# Altium schematic sheet 00_PINOUT.SchDoc
size A2
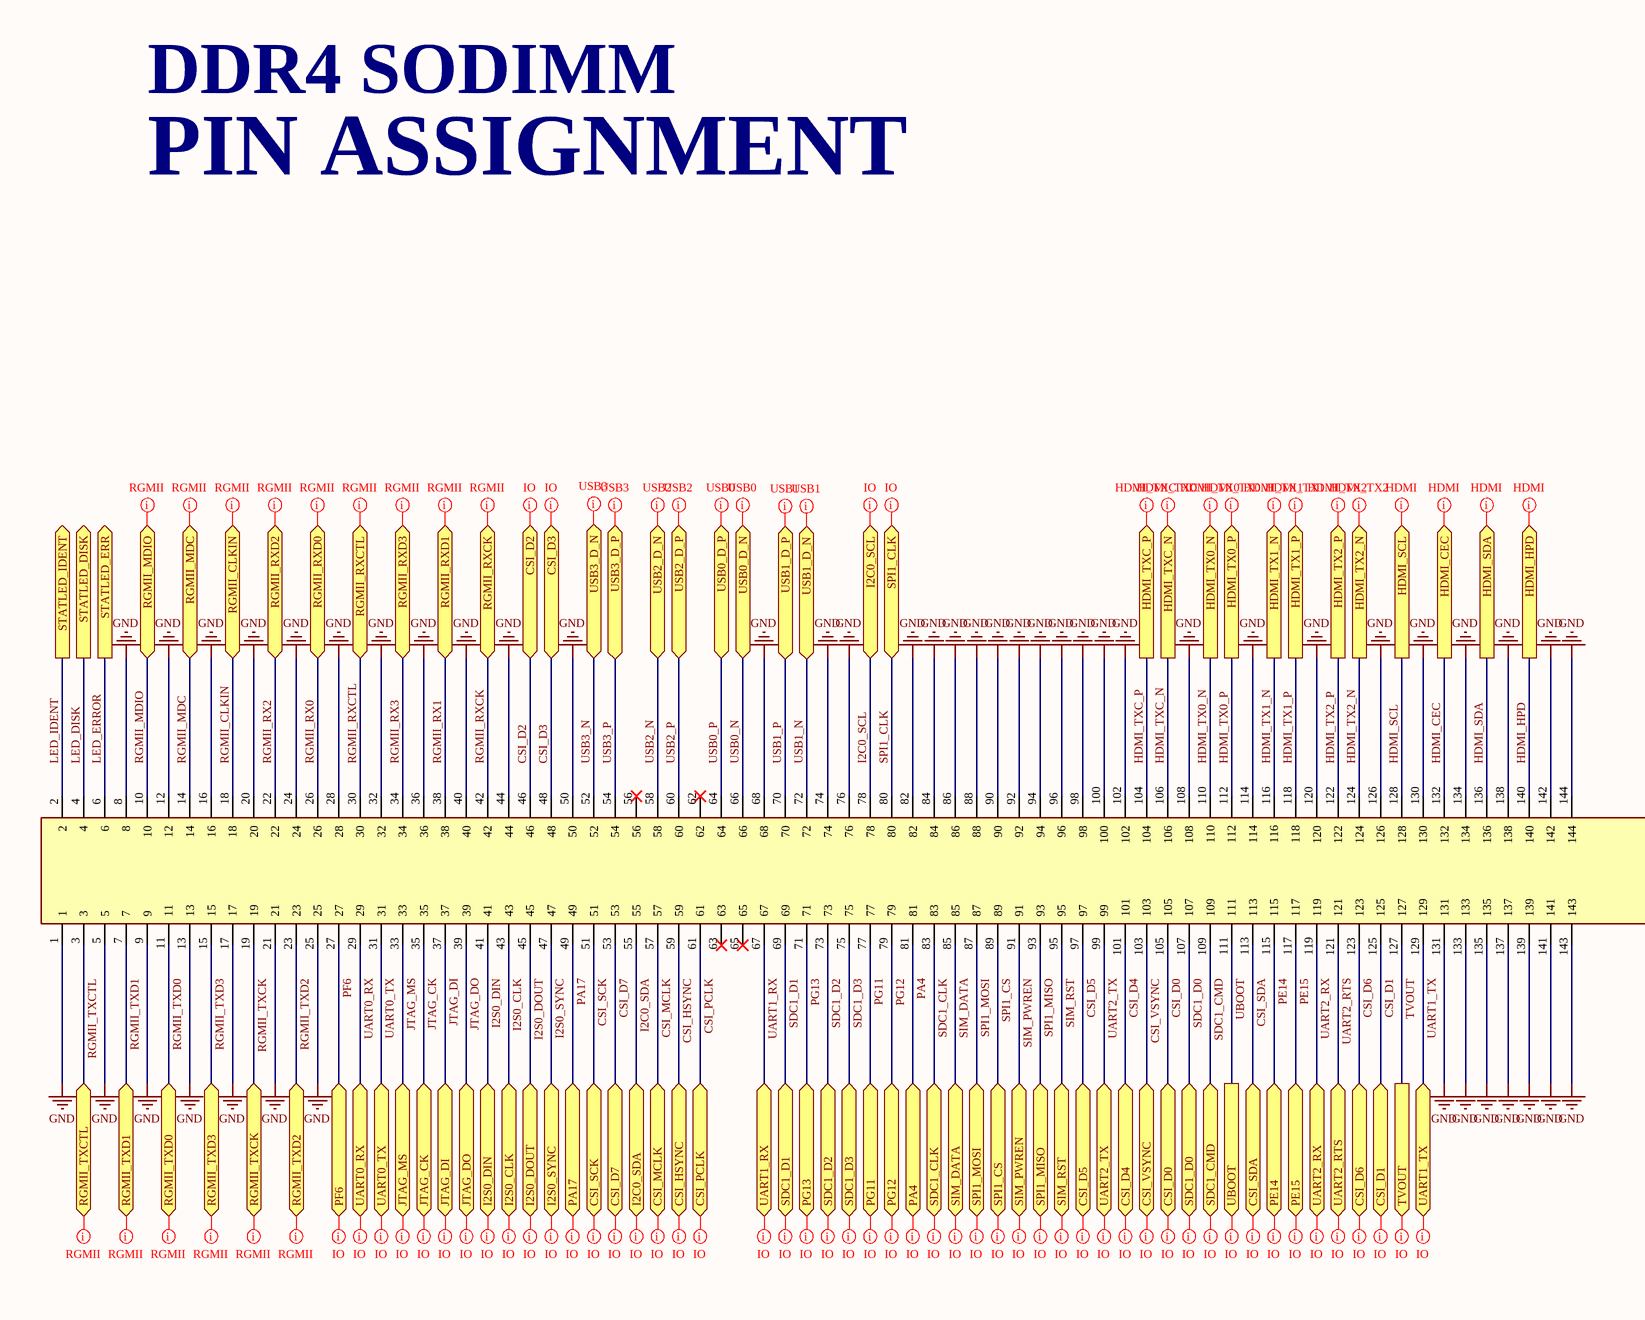
[diagram p0: 00_PINOUT.SchDoc, left]
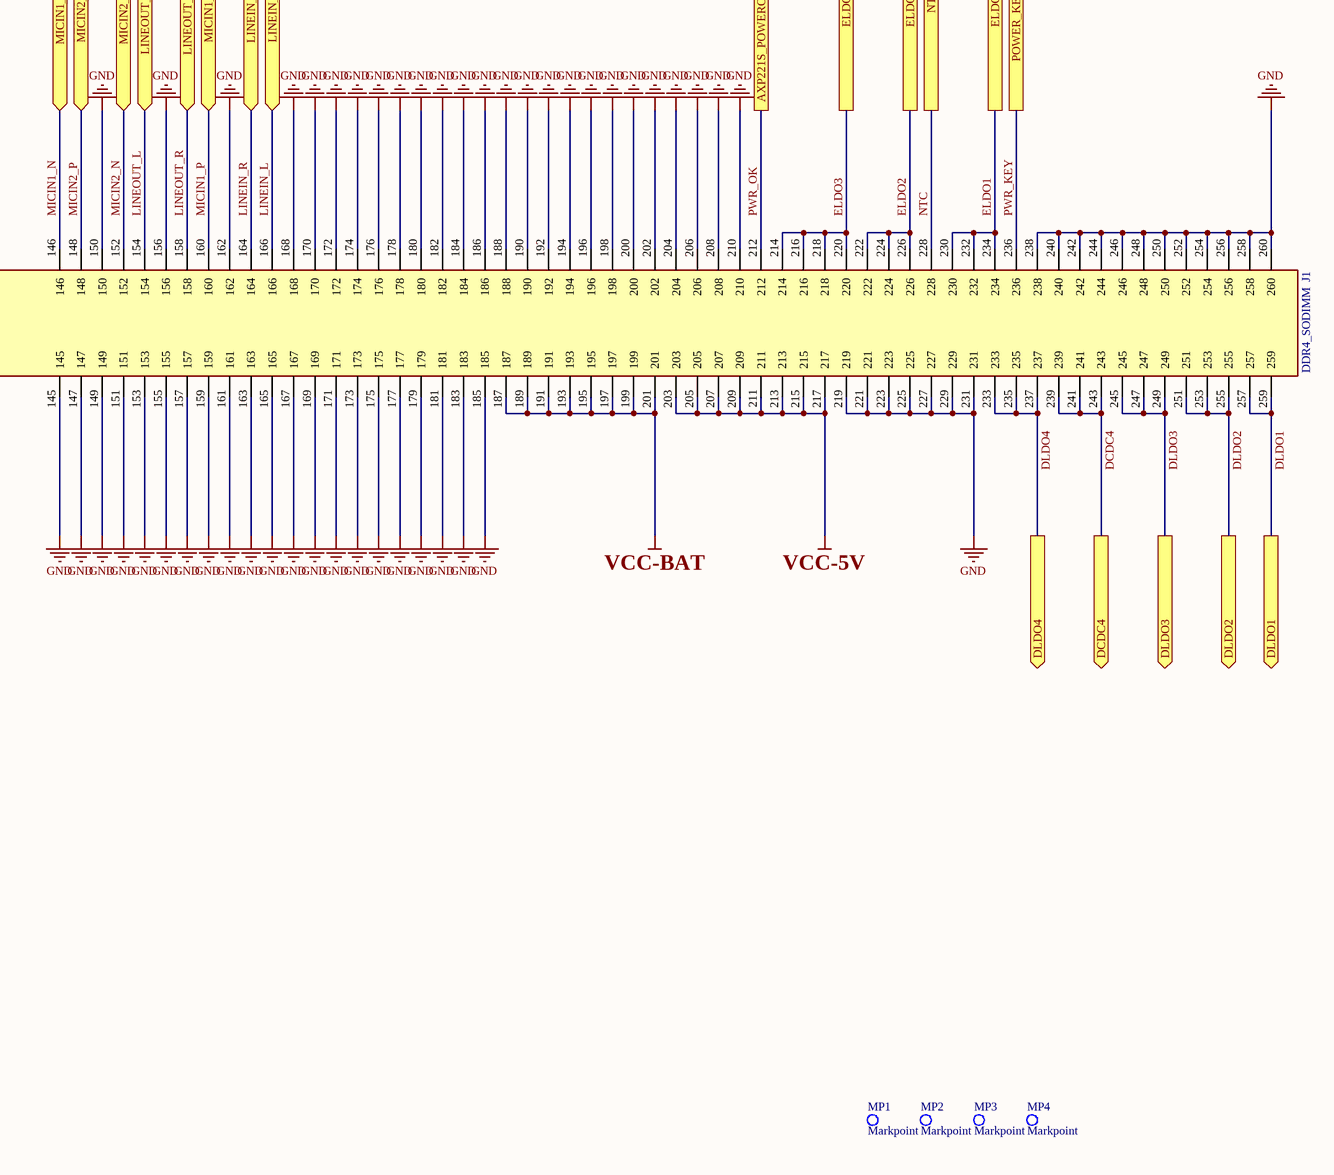
[diagram p1: 00_PINOUT.SchDoc, right]

## Parts
J1  DDR4_SODIMM  [DDR4_SODIMM]
MP1  Markpoint  [MARKPOINT]
MP2  Markpoint  [MARKPOINT]
MP3  Markpoint  [MARKPOINT]
MP4  Markpoint  [MARKPOINT]

## Ports
AXP221S_POWEROK (out), CSI_D0 (bidir), CSI_D1 (bidir), CSI_D2 (bidir), CSI_D3 (bidir), CSI_D4 (bidir), CSI_D5 (bidir), CSI_D6 (bidir), CSI_D7 (bidir), CSI_HSYNC (bidir), CSI_MCLK (bidir), CSI_PCLK (bidir), CSI_SCK (bidir), CSI_SDA (bidir), CSI_VSYNC (bidir), DCDC4 (out), DLDO1 (out), DLDO2 (out), DLDO3 (out), DLDO4 (out), ELDO1 (out), ELDO2 (out), ELDO3 (out), HDMI_CEC (out), HDMI_HPD (out), HDMI_SCL (out), HDMI_SDA (out), HDMI_TX0_N (out), HDMI_TX0_P (out), HDMI_TX1_N (out), HDMI_TX1_P (out), HDMI_TX2_N (out), HDMI_TX2_P (out), HDMI_TXC_N (out), HDMI_TXC_P (out), I2C0_SCL (bidir), I2C0_SDA (bidir), I2S0_CLK (bidir), I2S0_DIN (bidir), I2S0_DOUT (bidir), I2S0_SYNC (bidir), JTAG_CK (bidir), JTAG_DI (bidir), JTAG_DO (bidir), JTAG_MS (bidir), LINEIN_L (bidir), LINEIN_R (bidir), LINEOUT_L (bidir), LINEOUT_R (bidir), MICIN1_N (bidir), MICIN1_P (bidir), MICIN2_N (bidir), MICIN2_P (bidir), NTC (out), PA4 (bidir), PA17 (bidir), PE14 (bidir), PE15 (bidir), PF6 (bidir), PG11 (bidir), PG12 (bidir), PG13 (bidir), POWER_KEY (out), RGMII_CLKIN (bidir), RGMII_MDC (bidir), RGMII_MDIO (bidir), RGMII_RXCK (bidir), RGMII_RXCTL (bidir), RGMII_RXD0 (bidir), RGMII_RXD1 (bidir), RGMII_RXD2 (bidir), RGMII_RXD3 (bidir), RGMII_TXCK (bidir), RGMII_TXCTL (bidir), RGMII_TXD0 (bidir), RGMII_TXD1 (bidir), RGMII_TXD2 (bidir), RGMII_TXD3 (bidir), SDC1_CLK (bidir), SDC1_CMD (bidir), SDC1_D0 (bidir), SDC1_D1 (bidir), SDC1_D2 (bidir), SDC1_D3 (bidir), SIM_DATA (bidir), SIM_PWREN (bidir), SIM_RST (bidir), SPI1_CLK (bidir), SPI1_CS (bidir), SPI1_MISO (bidir), SPI1_MOSI (bidir), STATLED_DISK (out), STATLED_ERR (out), STATLED_IDENT (out), TVOUT (out), UART0_RX (bidir), UART0_TX (bidir), UART1_RX (bidir), UART1_TX (bidir), UART2_RTS (bidir), UART2_RX (bidir), UART2_TX (bidir), UBOOT (out), USB0_D_N (bidir), USB0_D_P (bidir), USB1_D_N (bidir), USB1_D_P (bidir), USB2_D_N (bidir), USB2_D_P (bidir), USB3_D_N (bidir), USB3_D_P (bidir)

## Nets
GND: J1.1 J1.5 J1.8 J1.9 J1.12 J1.13 J1.16 J1.17 J1.20 J1.21 J1.24 J1.25 J1.28 J1.32 J1.36 J1.40 J1.44 J1.50 J1.68 J1.74 J1.76 J1.82 J1.84 J1.86 J1.88 J1.90 J1.92 J1.94 J1.96 J1.98 J1.100 J1.102 J1.108 J1.114 J1.120 J1.126 J1.130 J1.131 J1.133 J1.134 J1.135 J1.137 J1.138 J1.139 J1.141 J1.142 J1.143 J1.144 J1.145 J1.147 J1.149 J1.150 J1.151 J1.153 J1.155 J1.156 J1.157 J1.159 J1.161 J1.162 J1.163 J1.165 J1.167 J1.168 J1.169 J1.170 J1.171 J1.172 J1.173 J1.174 J1.175 J1.176 J1.177 J1.178 J1.179 J1.180 J1.181 J1.182 J1.183 J1.184 J1.185 J1.186 J1.188 J1.190 J1.192 J1.194 J1.196 J1.198 J1.200 J1.202 J1.204 J1.206 J1.208 J1.210 J1.219 J1.221 J1.223 J1.225 J1.227 J1.229 J1.231 J1.238 J1.240 J1.242 J1.244 J1.246 J1.248 J1.250 J1.252 J1.254 J1.256 J1.258 J1.260
VCC-5V: J1.203 J1.205 J1.207 J1.209 J1.211 J1.213 J1.215 J1.217
VCC-BAT: J1.187 J1.189 J1.191 J1.193 J1.195 J1.197 J1.199 J1.201
CSI_D0: J1.105 ; port CSI_D0
CSI_D1: J1.125 ; port CSI_D1
CSI_D2: J1.46 ; port CSI_D2
CSI_D3: J1.48 ; port CSI_D3
CSI_D4: J1.101 ; port CSI_D4
CSI_D5: J1.97 ; port CSI_D5
CSI_D6: J1.123 ; port CSI_D6
CSI_D7: J1.53 ; port CSI_D7
CSI_HSYNC: J1.59 ; port CSI_HSYNC
CSI_MCLK: J1.57 ; port CSI_MCLK
CSI_PCLK: J1.61 ; port CSI_PCLK
CSI_SCK: J1.51 ; port CSI_SCK
CSI_SDA: J1.113 ; port CSI_SDA
CSI_VSYNC: J1.103 ; port CSI_VSYNC
DCDC4: J1.239 J1.241 J1.243 ; port DCDC4
DLDO1: J1.257 J1.259 ; port DLDO1
DLDO2: J1.251 J1.253 J1.255 ; port DLDO2
DLDO3: J1.245 J1.247 J1.249 ; port DLDO3
DLDO4: J1.233 J1.235 J1.237 ; port DLDO4
ELDO1: J1.230 J1.232 J1.234 ; port ELDO1
ELDO2: J1.222 J1.224 J1.226 ; port ELDO2
ELDO3: J1.214 J1.216 J1.218 J1.220 ; port ELDO3
HDMI_CEC: J1.132 ; port HDMI_CEC
HDMI_HPD: J1.140 ; port HDMI_HPD
HDMI_SCL: J1.128 ; port HDMI_SCL
HDMI_SDA: J1.136 ; port HDMI_SDA
HDMI_TX0_N: J1.110 ; port HDMI_TX0_N
HDMI_TX0_P: J1.112 ; port HDMI_TX0_P
HDMI_TX1_N: J1.116 ; port HDMI_TX1_N
HDMI_TX1_P: J1.118 ; port HDMI_TX1_P
HDMI_TX2_N: J1.124 ; port HDMI_TX2_N
HDMI_TX2_P: J1.122 ; port HDMI_TX2_P
HDMI_TXC_N: J1.106 ; port HDMI_TXC_N
HDMI_TXC_P: J1.104 ; port HDMI_TXC_P
I2C0_SCL: J1.78 ; port I2C0_SCL
I2C0_SDA: J1.55 ; port I2C0_SDA
I2S0_CLK: J1.43 ; port I2S0_CLK
I2S0_DIN: J1.41 ; port I2S0_DIN
I2S0_DOUT: J1.45 ; port I2S0_DOUT
I2S0_SYNC: J1.47 ; port I2S0_SYNC
JTAG_CK: J1.35 ; port JTAG_CK
JTAG_DI: J1.37 ; port JTAG_DI
JTAG_DO: J1.39 ; port JTAG_DO
JTAG_MS: J1.33 ; port JTAG_MS
LED_DISK: J1.4 ; port STATLED_DISK
LED_ERROR: J1.6 ; port STATLED_ERR
LED_IDENT: J1.2 ; port STATLED_IDENT
LINEIN_L: J1.166 ; port LINEIN_L
LINEIN_R: J1.164 ; port LINEIN_R
LINEOUT_L: J1.154 ; port LINEOUT_L
LINEOUT_R: J1.158 ; port LINEOUT_R
MICIN1_N: J1.146 ; port MICIN1_N
MICIN1_P: J1.160 ; port MICIN1_P
MICIN2_N: J1.152 ; port MICIN2_N
MICIN2_P: J1.148 ; port MICIN2_P
NTC: J1.228 ; port NTC
PA4: J1.81 ; port PA4
PA17: J1.49 ; port PA17
PE14: J1.115 ; port PE14
PE15: J1.117 ; port PE15
PF6: J1.27 ; port PF6
PG11: J1.77 ; port PG11
PG12: J1.79 ; port PG12
PG13: J1.71 ; port PG13
PWR_KEY: J1.236 ; port POWER_KEY
PWR_OK: J1.212 ; port AXP221S_POWEROK
RGMII_CLKIN: J1.18 ; port RGMII_CLKIN
RGMII_MDC: J1.14 ; port RGMII_MDC
RGMII_MDIO: J1.10 ; port RGMII_MDIO
RGMII_RX0: J1.26 ; port RGMII_RXD0
RGMII_RX1: J1.38 ; port RGMII_RXD1
RGMII_RX2: J1.22 ; port RGMII_RXD2
RGMII_RX3: J1.34 ; port RGMII_RXD3
RGMII_RXCK: J1.42 ; port RGMII_RXCK
RGMII_RXCTL: J1.30 ; port RGMII_RXCTL
RGMII_TXCK: J1.19 ; port RGMII_TXCK
RGMII_TXCTL: J1.3 ; port RGMII_TXCTL
RGMII_TXD0: J1.11 ; port RGMII_TXD0
RGMII_TXD1: J1.7 ; port RGMII_TXD1
RGMII_TXD2: J1.23 ; port RGMII_TXD2
RGMII_TXD3: J1.15 ; port RGMII_TXD3
SDC1_CLK: J1.83 ; port SDC1_CLK
SDC1_CMD: J1.109 ; port SDC1_CMD
SDC1_D0: J1.107 ; port SDC1_D0
SDC1_D1: J1.69 ; port SDC1_D1
SDC1_D2: J1.73 ; port SDC1_D2
SDC1_D3: J1.75 ; port SDC1_D3
SIM_DATA: J1.85 ; port SIM_DATA
SIM_PWREN: J1.91 ; port SIM_PWREN
SIM_RST: J1.95 ; port SIM_RST
SPI1_CLK: J1.80 ; port SPI1_CLK
SPI1_CS: J1.89 ; port SPI1_CS
SPI1_MISO: J1.93 ; port SPI1_MISO
SPI1_MOSI: J1.87 ; port SPI1_MOSI
TVOUT: J1.127 ; port TVOUT
UART0_RX: J1.29 ; port UART0_RX
UART0_TX: J1.31 ; port UART0_TX
UART1_RX: J1.67 ; port UART1_RX
UART1_TX: J1.129 ; port UART1_TX
UART2_RTS: J1.121 ; port UART2_RTS
UART2_RX: J1.119 ; port UART2_RX
UART2_TX: J1.99 ; port UART2_TX
UBOOT: J1.111 ; port UBOOT
USB0_N: J1.66 ; port USB0_D_N
USB0_P: J1.64 ; port USB0_D_P
USB1_N: J1.72 ; port USB1_D_N
USB1_P: J1.70 ; port USB1_D_P
USB2_N: J1.58 ; port USB2_D_N
USB2_P: J1.60 ; port USB2_D_P
USB3_N: J1.52 ; port USB3_D_N
USB3_P: J1.54 ; port USB3_D_P

Not connected (* = marked no-connect by the designer): J1 56* 62* 63* 65*

## Layout directives
differential pair; differential pair class USB0; rule Differential Pairs Routing [Pref Gap = 6mil    Min Gap  = 6mil    Max Gap  = 6milPref Width = 4.29mil    Min Width  = 4.29mil    Max Width  = 4.29mil]; net class USB: USB0_N, USB0_P
differential pair; differential pair class USB2; rule Differential Pairs Routing [Pref Gap = 6mil    Min Gap  = 6mil    Max Gap  = 6milPref Width = 4.29mil    Min Width  = 4.29mil    Max Width  = 4.29mil]; net class USB: USB2_N, USB2_P
differential pair; differential pair class USB3; rule Differential Pairs Routing [Pref Gap = 6mil    Min Gap  = 6mil    Max Gap  = 6milPref Width = 4.29mil    Min Width  = 4.29mil    Max Width  = 4.29mil]; net class USB: USB3_N, USB3_P
differential pair; differential pair class USB1; rule Differential Pairs Routing [Pref Gap = 6mil    Min Gap  = 6mil    Max Gap  = 6milPref Width = 4.29mil    Min Width  = 4.29mil    Max Width  = 4.29mil]; net class USB: USB1_N, USB1_P
net class RGMII; rule Width Constraint [Pref Width = 5mil    Min Width = 4mil    Max Width = 5mil]: RGMII_CLKIN, RGMII_MDC, RGMII_MDIO, RGMII_RX0, RGMII_RX1, RGMII_RX2, RGMII_RX3, RGMII_RXCK, RGMII_RXCTL, RGMII_TXCK, RGMII_TXCTL, RGMII_TXD0, RGMII_TXD1, RGMII_TXD2, RGMII_TXD3
net class GPIO: I2C0_SCL, I2C0_SDA, I2S0_CLK, I2S0_DIN, I2S0_DOUT, I2S0_SYNC, JTAG_CK, JTAG_DI, JTAG_DO, JTAG_MS, LINEIN_L, LINEIN_R, LINEOUT_L, LINEOUT_R, MICIN1_N, MICIN1_P, MICIN2_N, MICIN2_P, PA4, PA17, PE14, PE15, PF6, PG11, PG12, PG13, SDC1_CLK, SDC1_CMD, SDC1_D0, SDC1_D1, SDC1_D2, SDC1_D3, SIM_DATA, SIM_PWREN, SIM_RST, SPI1_CLK, SPI1_CS, SPI1_MISO, SPI1_MOSI, TVOUT, UART0_RX, UART0_TX, UART1_RX, UART1_TX, UART2_RTS, UART2_RX, UART2_TX, UBOOT
differential pair; differential pair class HDMI_TX0; rule Differential Pairs Routing [Pref Gap = 6mil    Min Gap  = 6mil    Max Gap  = 6milPref Width = 4.29mil    Min Width  = 4.29mil    Max Width  = 4.29mil]; net class HDMI: HDMI_TX0_N, HDMI_TX0_P
differential pair; differential pair class HDMI_TX1; rule Differential Pairs Routing [Pref Gap = 6mil    Min Gap  = 6mil    Max Gap  = 6milPref Width = 4.29mil    Min Width  = 4.29mil    Max Width  = 4.29mil]; net class HDMI: HDMI_TX1_N, HDMI_TX1_P
differential pair; differential pair class HDMI_TX2; rule Differential Pairs Routing [Pref Gap = 6mil    Min Gap  = 6mil    Max Gap  = 6milPref Width = 4.29mil    Min Width  = 4.29mil    Max Width  = 4.29mil]; net class HDMI: HDMI_TX2_N, HDMI_TX2_P
differential pair; differential pair class HDMI_TXC; rule Differential Pairs Routing [Pref Gap = 6mil    Min Gap  = 6mil    Max Gap  = 6milPref Width = 4.29mil    Min Width  = 4.29mil    Max Width  = 4.29mil]; net class HDMI: HDMI_TXC_N, HDMI_TXC_P
net class GPIO; net class CSI: CSI_D0, CSI_D1, CSI_D2, CSI_D3, CSI_D4, CSI_D5, CSI_D6, CSI_D7, CSI_HSYNC, CSI_MCLK, CSI_PCLK, CSI_SCK, CSI_SDA, CSI_VSYNC
net class HDMI; rule Width Constraint [Pref Width = 5mil    Min Width = 4mil    Max Width = 5mil]: HDMI_CEC, HDMI_HPD, HDMI_SCL, HDMI_SDA

## Notes on the sheet
- DDR4 SODIMM
- PIN ASSIGNMENT